# EAGLE schematic pdb (EAGLE 9.1.3)

## Sheet 1 of 6: 5V-Reg
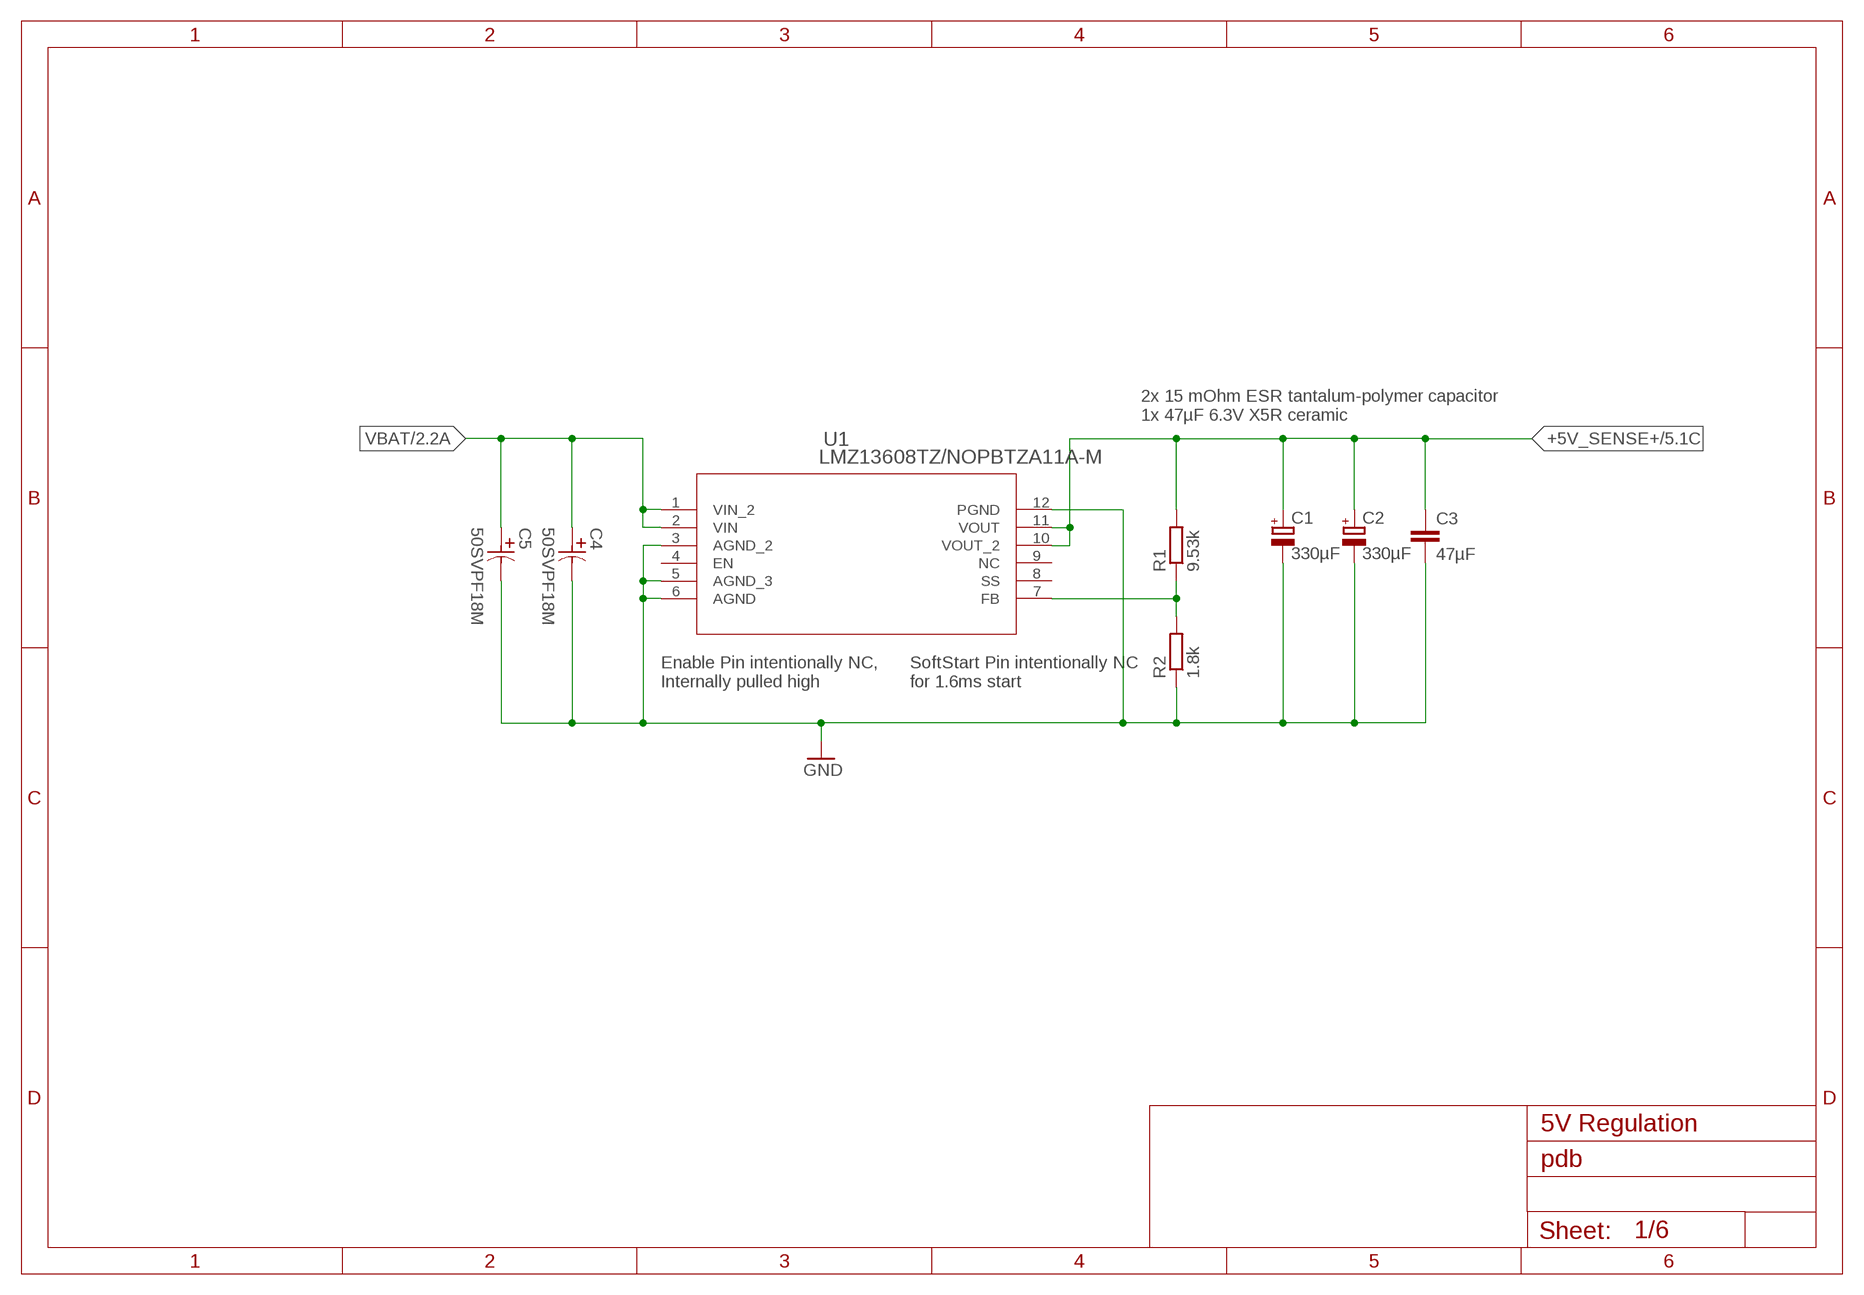
[diagram p0: schematic, sheet 1]

### Parts
C1  330µF  CPOL-EUCT7343  [CT7343]
C2  330µF  CPOL-EUCT7343  [CT7343]
C3  47µF  C-EUC0603  [C0603]
C4  50SVPF18M  [PCAP_SVP_E7]
C5  50SVPF18M  [PCAP_SVP_E7]
R1  9.53k  R-EU_R0603  [R0603]
R2  1.8k  R-EU_R0603  [R0603]
U1  LMZ13608TZ/NOPBTZA11A-M  [TZA11A-M]

### Nets
+5V_SENSE+: C1.+ C2.+ C3.1 R1.2 U1.10(VOUT_2) U1.11(VOUT) ; also sheet 5
GND: C1.- C2.- C3.2 C4.2 C5.2 R2.1 U1.3(AGND_2) U1.5(AGND_3) U1.6(AGND) U1.12(PGND) ; also sheet 2,3,4,5,6
N$1: R1.1 R2.2 U1.7(FB)
VBAT: C4.1 C5.1 U1.1(VIN_2) U1.2(VIN) ; also sheet 2,5,6
Unconnected: U1.4(EN) U1.8(SS) U1.9(NC)

### Notes on the sheet
- 2x 15 mOhm ESR tantalum-polymer capacitor
  1x 47µF 6.3V X5R ceramic
- Enable Pin intentionally NC,
  Internally pulled high
- SoftStart Pin intentionally NC
  for 1.6ms start
- 5V Regulation

## Sheet 2 of 6: 3.3V-Reg
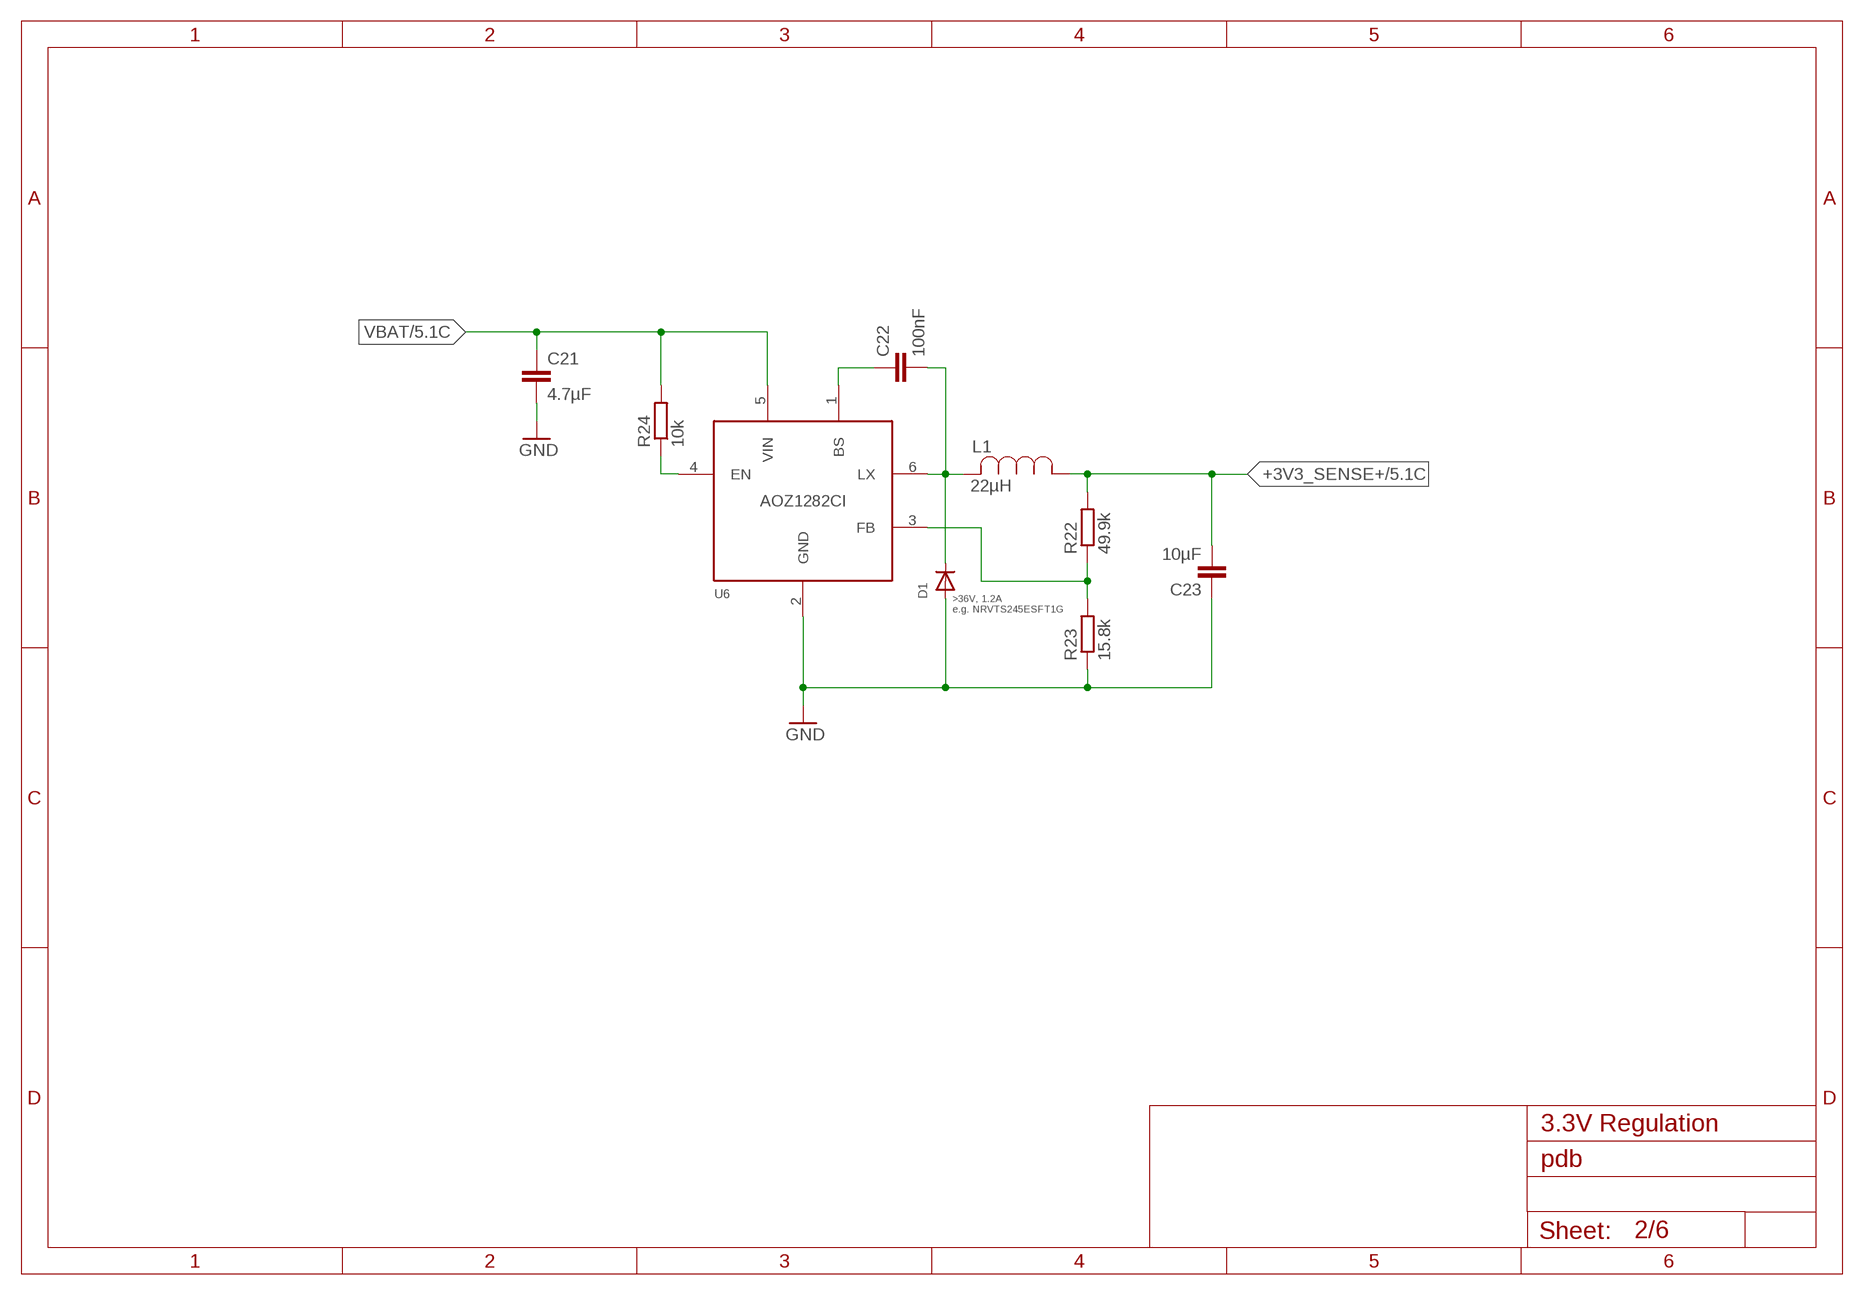
[diagram p1: schematic, sheet 2]

### Parts
C21  4.7µF  C-EUC0603  [C0603]
C22  100nF  C-EUC0603  [C0603]
C23  10µF  C-EUC0603  [C0603]
D1  DIODE_SOD-123FL  [SOD-123FL]
L1  22µH  NRS6045  [IND_TAIYO_NRS6045]
R22  49.9k  R-EU_R0603  [R0603]
R23  15.8k  R-EU_R0603  [R0603]
R24  10k  R-EU_R0603  [R0603]
U6  AOZ1282CI  [SOT95P280X125-6]

### Nets
+3V3_SENSE+: C23.2 L1.1 R22.2 ; also sheet 5
GND: C21.2 C23.1 D1.A R23.1 U6.2(GND) ; also sheet 1,3,4,5,6
N$24: R22.1 R23.2 U6.3(FB)
N$27: C22.2 D1.C L1.2 U6.6(LX)
N$28: C22.1 U6.1(BS)
N$30: R24.1 U6.4(EN)
VBAT: C21.1 R24.2 U6.5(VIN) ; also sheet 1,5,6

### Notes on the sheet
- >36V, 1.2A
  e.g. NRVTS245ESFT1G
- 3.3V Regulation

## Sheet 3 of 6: Microcontroller
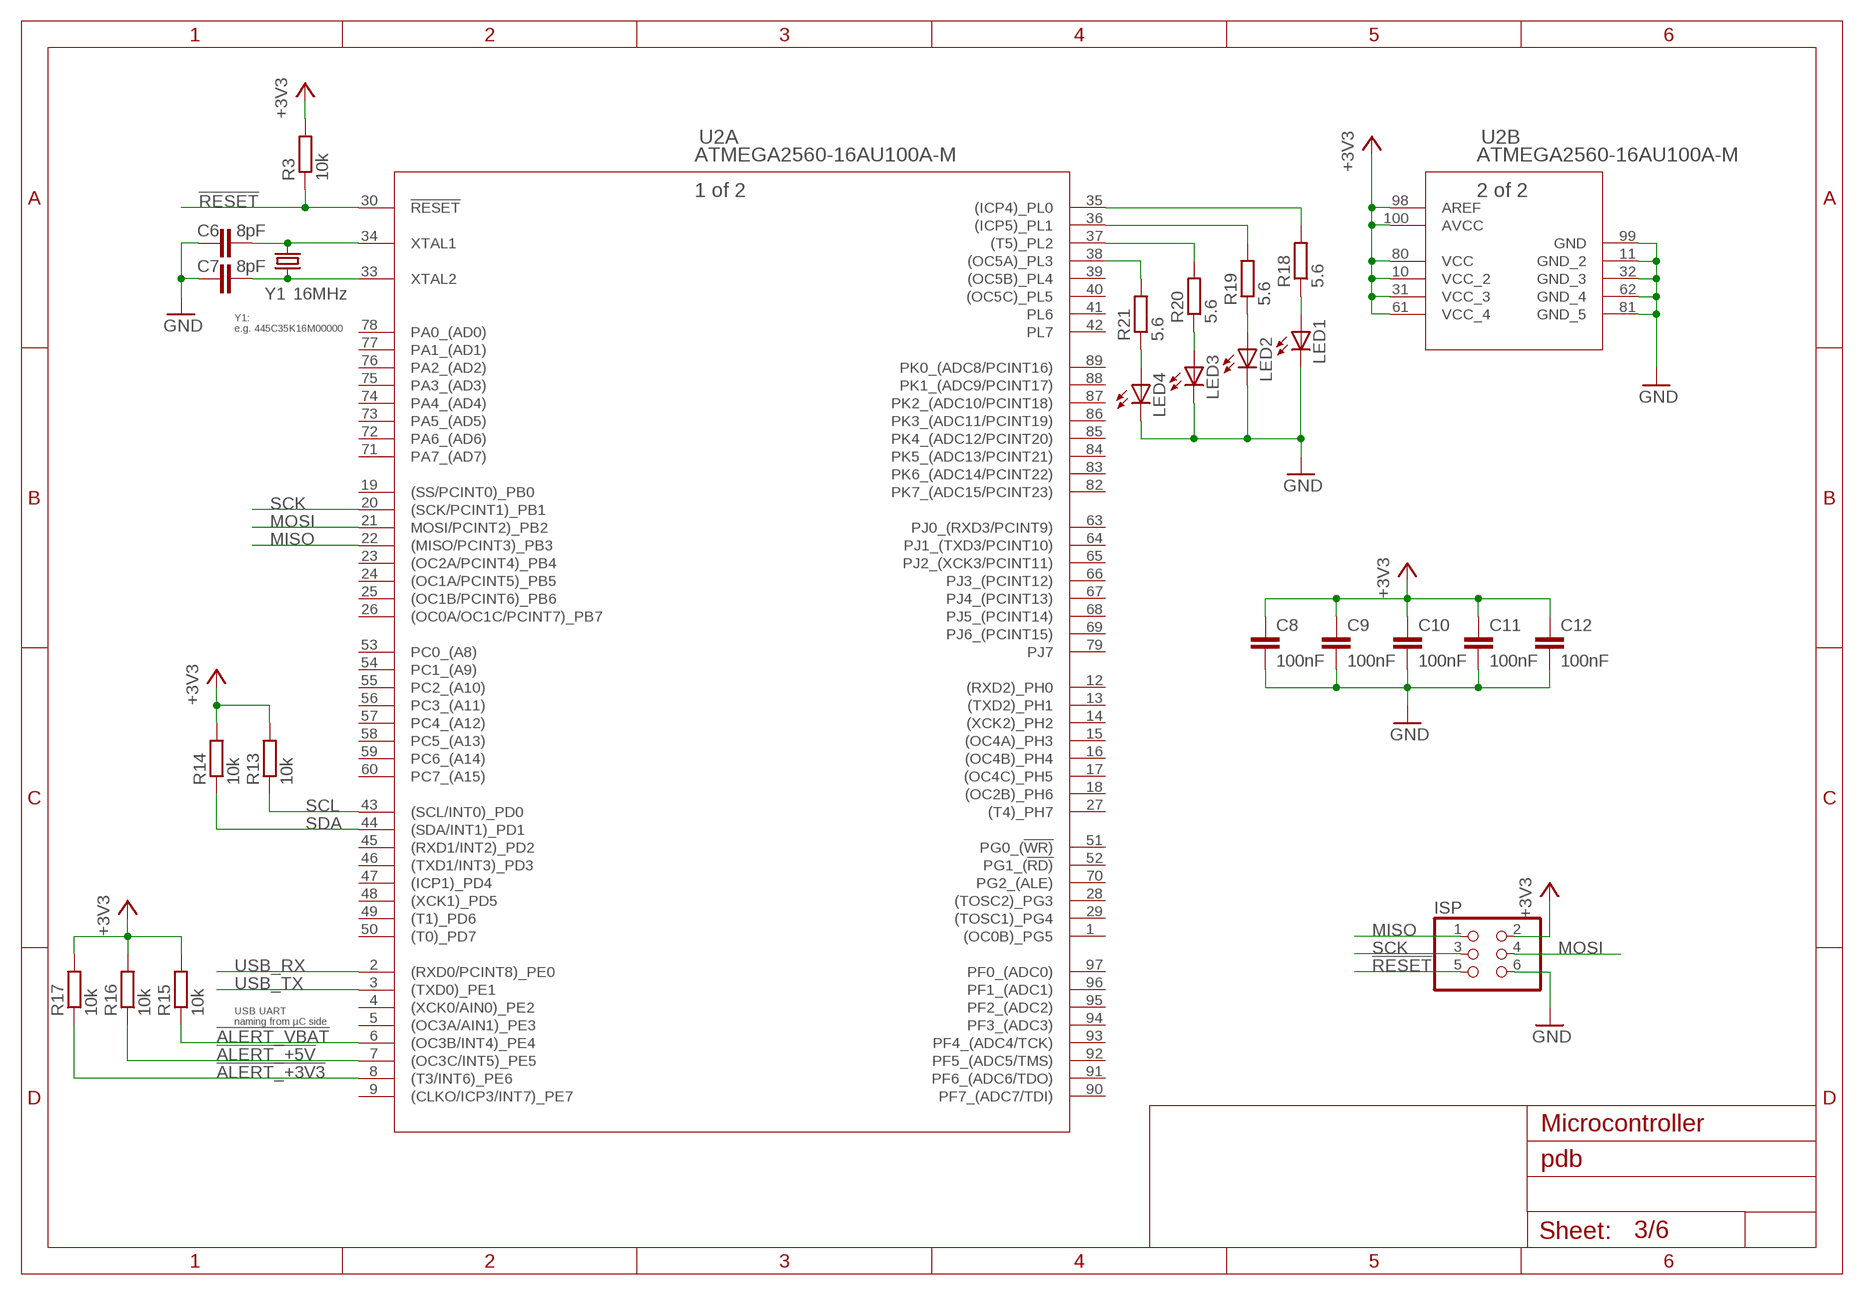
[diagram p2: schematic, sheet 3]

### Parts
C6  8pF  C-EUC0603  [C0603]
C7  8pF  C-EUC0603  [C0603]
C8  100nF  C-EUC0603  [C0603]
C9  100nF  C-EUC0603  [C0603]
C10  100nF  C-EUC0603  [C0603]
C11  100nF  C-EUC0603  [C0603]
C12  100nF  C-EUC0603  [C0603]
ISP  PINHD-2X3  [2X03]
LED1  LEDCHIP-LED0603  [CHIP-LED0603]
LED2  LEDCHIP-LED0603  [CHIP-LED0603]
LED3  LEDCHIP-LED0603  [CHIP-LED0603]
LED4  LEDCHIP-LED0603  [CHIP-LED0603]
R3  10k  R-EU_R0603  [R0603]
R13  10k  R-EU_R0603  [R0603]
R14  10k  R-EU_R0603  [R0603]
R15  10k  R-EU_R0603  [R0603]
R16  10k  R-EU_R0603  [R0603]
R17  10k  R-EU_R0603  [R0603]
R18  5.6  R-EU_R0603  [R0603]
R19  5.6  R-EU_R0603  [R0603]
R20  5.6  R-EU_R0603  [R0603]
R21  5.6  R-EU_R0603  [R0603]
U2  ATMEGA2560-16AU100A-M  [100A-M]
Y1  16MHz  CRYSTALSMD-5X3.2-2PAD  [CRYSTAL-SMD-5X3.2-2PAD]

### Nets
!ALERT_+3V3: R17.1 U2.8(A:(T3/INT6)_PE6) ; also sheet 5
!ALERT_+5V: R16.1 U2.7(A:(OC3C/INT5)_PE5) ; also sheet 5
!ALERT_VBAT: R15.1 U2.6(A:(OC3B/INT4)_PE4) ; also sheet 5
!RESET: ISP.5 R3.1 U2.30(A:!RESET)
+3V3: R13.2 R14.2 R15.2 R16.2 R17.2 ; also sheet 5,6
+5V: C8.1 C9.1 C10.1 C11.1 C12.1 ISP.2 R3.2 U2.10(B:VCC_2) U2.31(B:VCC_3) U2.61(B:VCC_4) U2.80(B:VCC) U2.98(B:AREF) U2.100(B:AVCC) ; supply symbol labelled +3V3 ; also sheet 4,5,6
GND: C6.1 C7.1 C8.2 C9.2 C10.2 C11.2 C12.2 ISP.6 LED1.C LED2.C LED3.C LED4.C U2.11(B:GND_2) U2.32(B:GND_3) U2.62(B:GND_4) U2.81(B:GND_5) U2.99(B:GND) ; also sheet 1,2,4,5,6
MISO: ISP.1 U2.22(A:(MISO/PCINT3)_PB3)
MOSI: ISP.4 U2.21(A:MOSI/PCINT2)_PB2)
N$2: C6.2 U2.34(A:XTAL1) Y1.P$2
N$3: C7.2 U2.33(A:XTAL2) Y1.P$1
N$14: R21.2 U2.38(A:(OC5A)_PL3)
N$17: R20.2 U2.37(A:(T5)_PL2)
N$18: R19.2 U2.36(A:(ICP5)_PL1)
N$19: R18.2 U2.35(A:(ICP4)_PL0)
N$20: LED1.A R18.1
N$21: LED2.A R19.1
N$22: LED3.A R20.1
N$23: LED4.A R21.1
SCK: ISP.3 U2.20(A:(SCK/PCINT1)_PB1)
SCL: R13.1 U2.43(A:(SCL/INT0)_PD0) ; also sheet 5
SDA: R14.1 U2.44(A:(SDA/INT1)_PD1) ; also sheet 5
USB_RX: U2.2(A:(RXD0/PCINT8)_PE0) ; also sheet 4
USB_TX: U2.3(A:(TXD0)_PE1) ; also sheet 4
Unconnected: U2.1(A:(OC0B)_PG5) U2.4(A:(XCK0/AIN0)_PE2) U2.5(A:(OC3A/AIN1)_PE3) U2.9(A:(CLKO/ICP3/INT7)_PE7) U2.12(A:(RXD2)_PH0) U2.13(A:(TXD2)_PH1) U2.14(A:(XCK2)_PH2) U2.15(A:(OC4A)_PH3) U2.16(A:(OC4B)_PH4) U2.17(A:(OC4C)_PH5) U2.18(A:(OC2B)_PH6) U2.19(A:(SS/PCINT0)_PB0) U2.23(A:(OC2A/PCINT4)_PB4) U2.24(A:(OC1A/PCINT5)_PB5) U2.25(A:(OC1B/PCINT6)_PB6) U2.26(A:(OC0A/OC1C/PCINT7)_PB7) U2.27(A:(T4)_PH7) U2.28(A:(TOSC2)_PG3) U2.29(A:(TOSC1)_PG4) U2.39(A:(OC5B)_PL4) U2.40(A:(OC5C)_PL5) U2.41(A:PL6) U2.42(A:PL7) U2.45(A:(RXD1/INT2)_PD2) U2.46(A:(TXD1/INT3)_PD3) U2.47(A:(ICP1)_PD4) U2.48(A:(XCK1)_PD5) U2.49(A:(T1)_PD6) U2.50(A:(T0)_PD7) U2.51(A:PG0_(!WR)) U2.52(A:PG1_(!RD)) U2.53(A:PC0_(A8)) U2.54(A:PC1_(A9)) U2.55(A:PC2_(A10)) U2.56(A:PC3_(A11)) U2.57(A:PC4_(A12)) U2.58(A:PC5_(A13)) U2.59(A:PC6_(A14)) U2.60(A:PC7_(A15)) U2.63(A:PJ0_(RXD3/PCINT9)) U2.64(A:PJ1_(TXD3/PCINT10)) U2.65(A:PJ2_(XCK3/PCINT11)) U2.66(A:PJ3_(PCINT12)) U2.67(A:PJ4_(PCINT13)) U2.68(A:PJ5_(PCINT14)) U2.69(A:PJ6_(PCINT15)) U2.70(A:PG2_(ALE)) U2.71(A:PA7_(AD7)) U2.72(A:PA6_(AD6)) U2.73(A:PA5_(AD5)) U2.74(A:PA4_(AD4)) U2.75(A:PA3_(AD3)) U2.76(A:PA2_(AD2)) U2.77(A:PA1_(AD1)) U2.78(A:PA0_(AD0)) U2.79(A:PJ7) U2.82(A:PK7_(ADC15/PCINT23)) U2.83(A:PK6_(ADC14/PCINT22)) U2.84(A:PK5_(ADC13/PCINT21)) U2.85(A:PK4_(ADC12/PCINT20)) U2.86(A:PK3_(ADC11/PCINT19)) U2.87(A:PK2_(ADC10/PCINT18)) U2.88(A:PK1_(ADC9/PCINT17)) U2.89(A:PK0_(ADC8/PCINT16)) U2.90(A:PF7_(ADC7/TDI)) U2.91(A:PF6_(ADC6/TDO)) U2.92(A:PF5_(ADC5/TMS)) U2.93(A:PF4_(ADC4/TCK)) U2.94(A:PF3_(ADC3)) U2.95(A:PF2_(ADC2)) U2.96(A:PF1_(ADC1)) U2.97(A:PF0_(ADC0))

### Notes on the sheet
- Y1:
  e.g. 445C35K16M00000
- USB UART
  naming from µC side
- Microcontroller

## Sheet 4 of 6: USB-UART
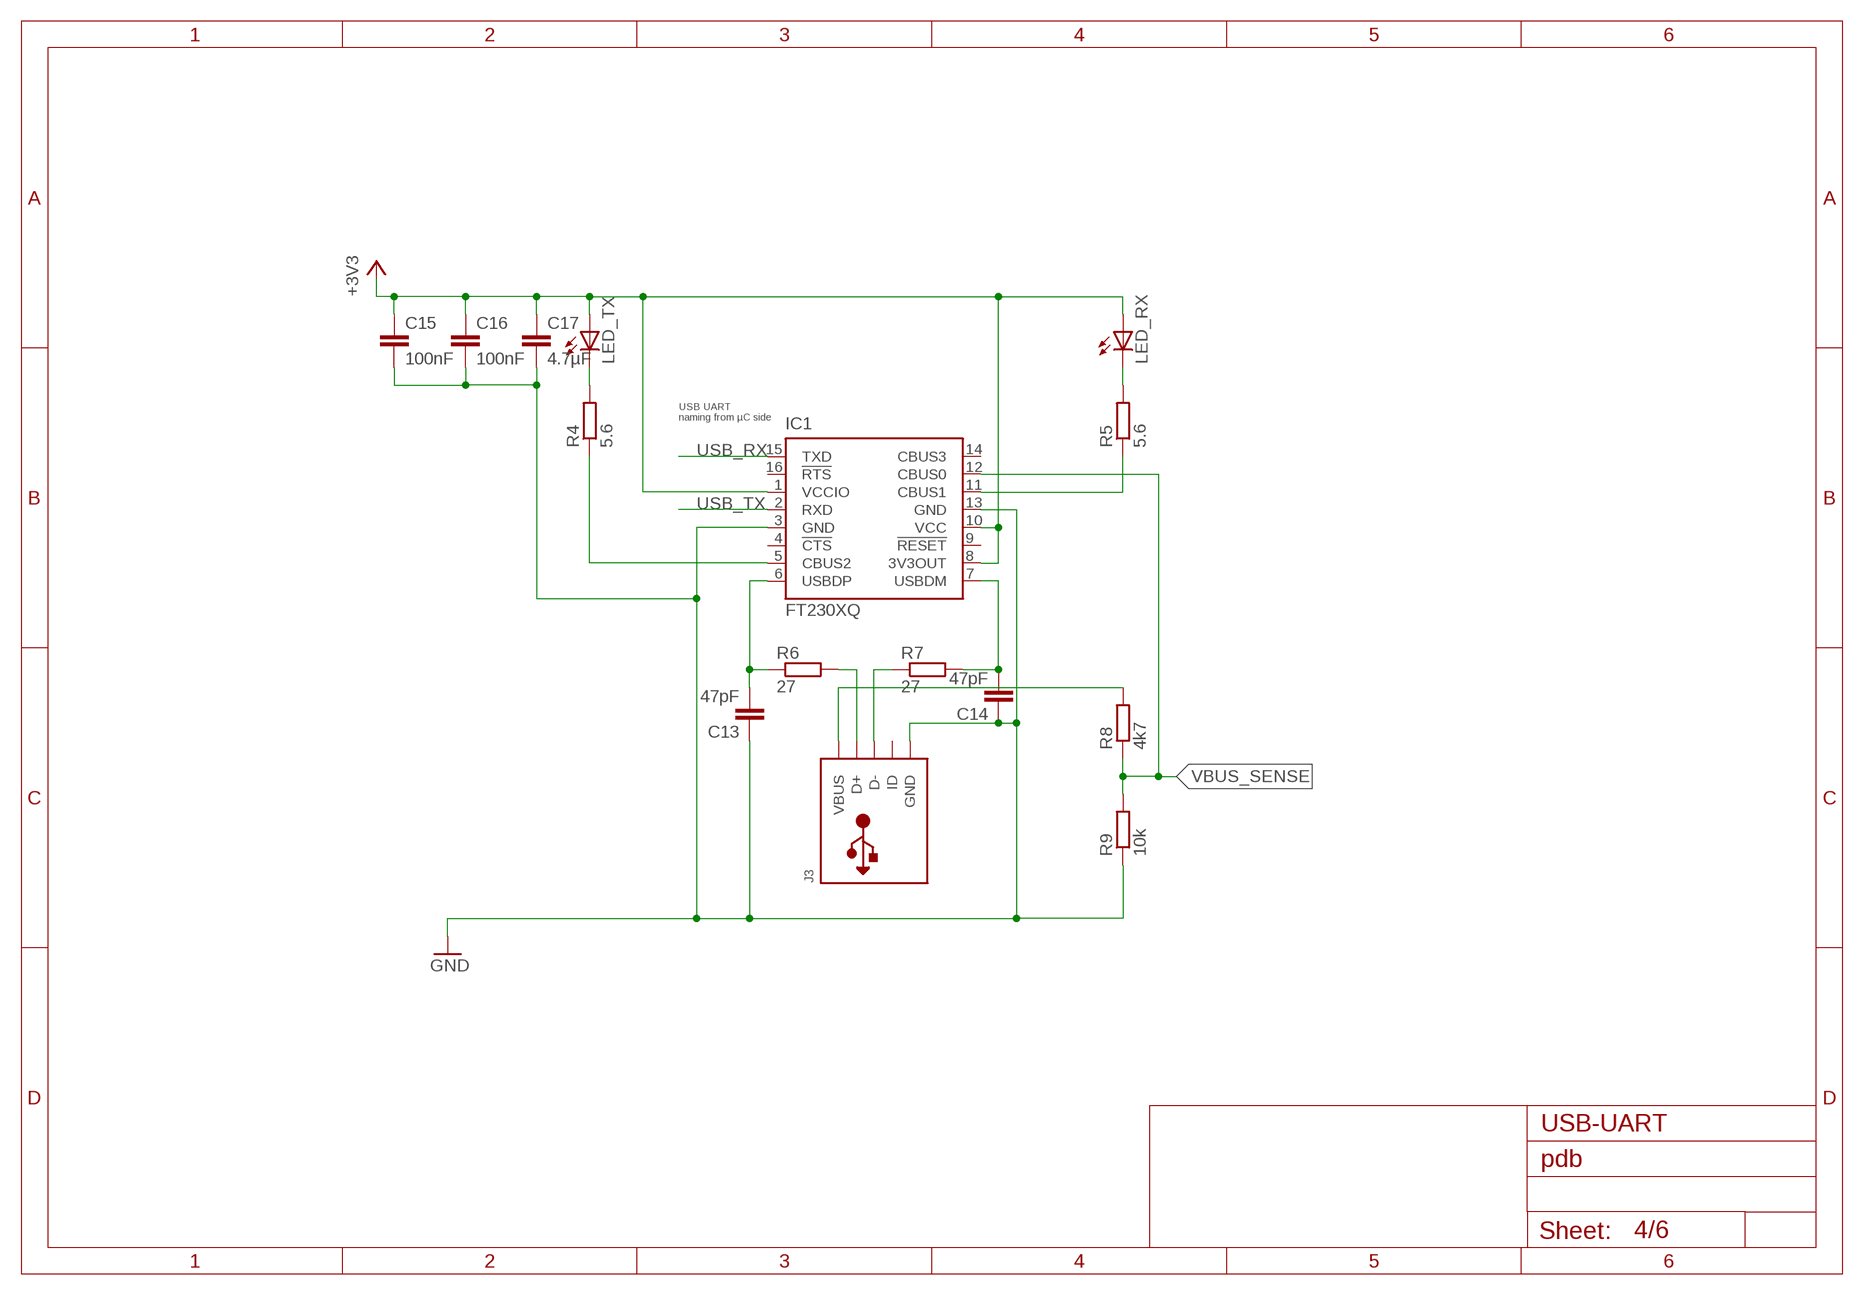
[diagram p3: schematic, sheet 4]

### Parts
C13  47pF  C-EUC0603  [C0603]
C14  47pF  C-EUC0603  [C0603]
C15  100nF  C-EUC0603  [C0603]
C16  100nF  C-EUC0603  [C0603]
C17  4.7µF  C-EUC0603  [C0603]
IC1  FT230XQ  [QFN16]
J3  USBMINIB  [USB-MINIB]
LED_RX  LEDCHIP-LED0603  [CHIP-LED0603]
LED_TX  LEDCHIP-LED0603  [CHIP-LED0603]
R4  5.6  R-EU_R0603  [R0603]
R5  5.6  R-EU_R0603  [R0603]
R6  27  R-EU_R0603  [R0603]
R7  27  R-EU_R0603  [R0603]
R8  4k7  R-EU_R0603  [R0603]
R9  10k  R-EU_R0603  [R0603]

### Nets
+5V: C15.1 C16.1 C17.1 IC1.1(VCCIO) IC1.8(3V3OUT) IC1.10(VCC) LED_RX.A LED_TX.A ; supply symbol labelled +3V3 ; also sheet 3,5,6
GND: C13.1 C14.1 C15.2 C16.2 C17.2 IC1.3(GND) IC1.13(GND) J3.GND R9.1 ; also sheet 1,2,3,5,6
N$4: C13.2 IC1.6(USBDP) R6.1
N$5: C14.2 IC1.7(USBDM) R7.2
N$6: IC1.5(CBUS2) R4.1
N$7: IC1.11(CBUS1) R5.1
N$8: LED_TX.C R4.2
N$9: LED_RX.C R5.2
N$10: J3.D+ R6.2
N$11: J3.D- R7.1
N$16: J3.VBUS R8.2
USB_RX: IC1.15(TXD) ; also sheet 3
USB_TX: IC1.2(RXD) ; also sheet 3
VBUS_SENSE: IC1.12(CBUS0) R8.1 R9.2
Unconnected: IC1.4(!CTS) IC1.9(!RESET) IC1.14(CBUS3) IC1.16(!RTS) J3.ID

### Notes on the sheet
- USB UART
  naming from µC side
- USB-UART

## Sheet 5 of 6: Supply Monitoring
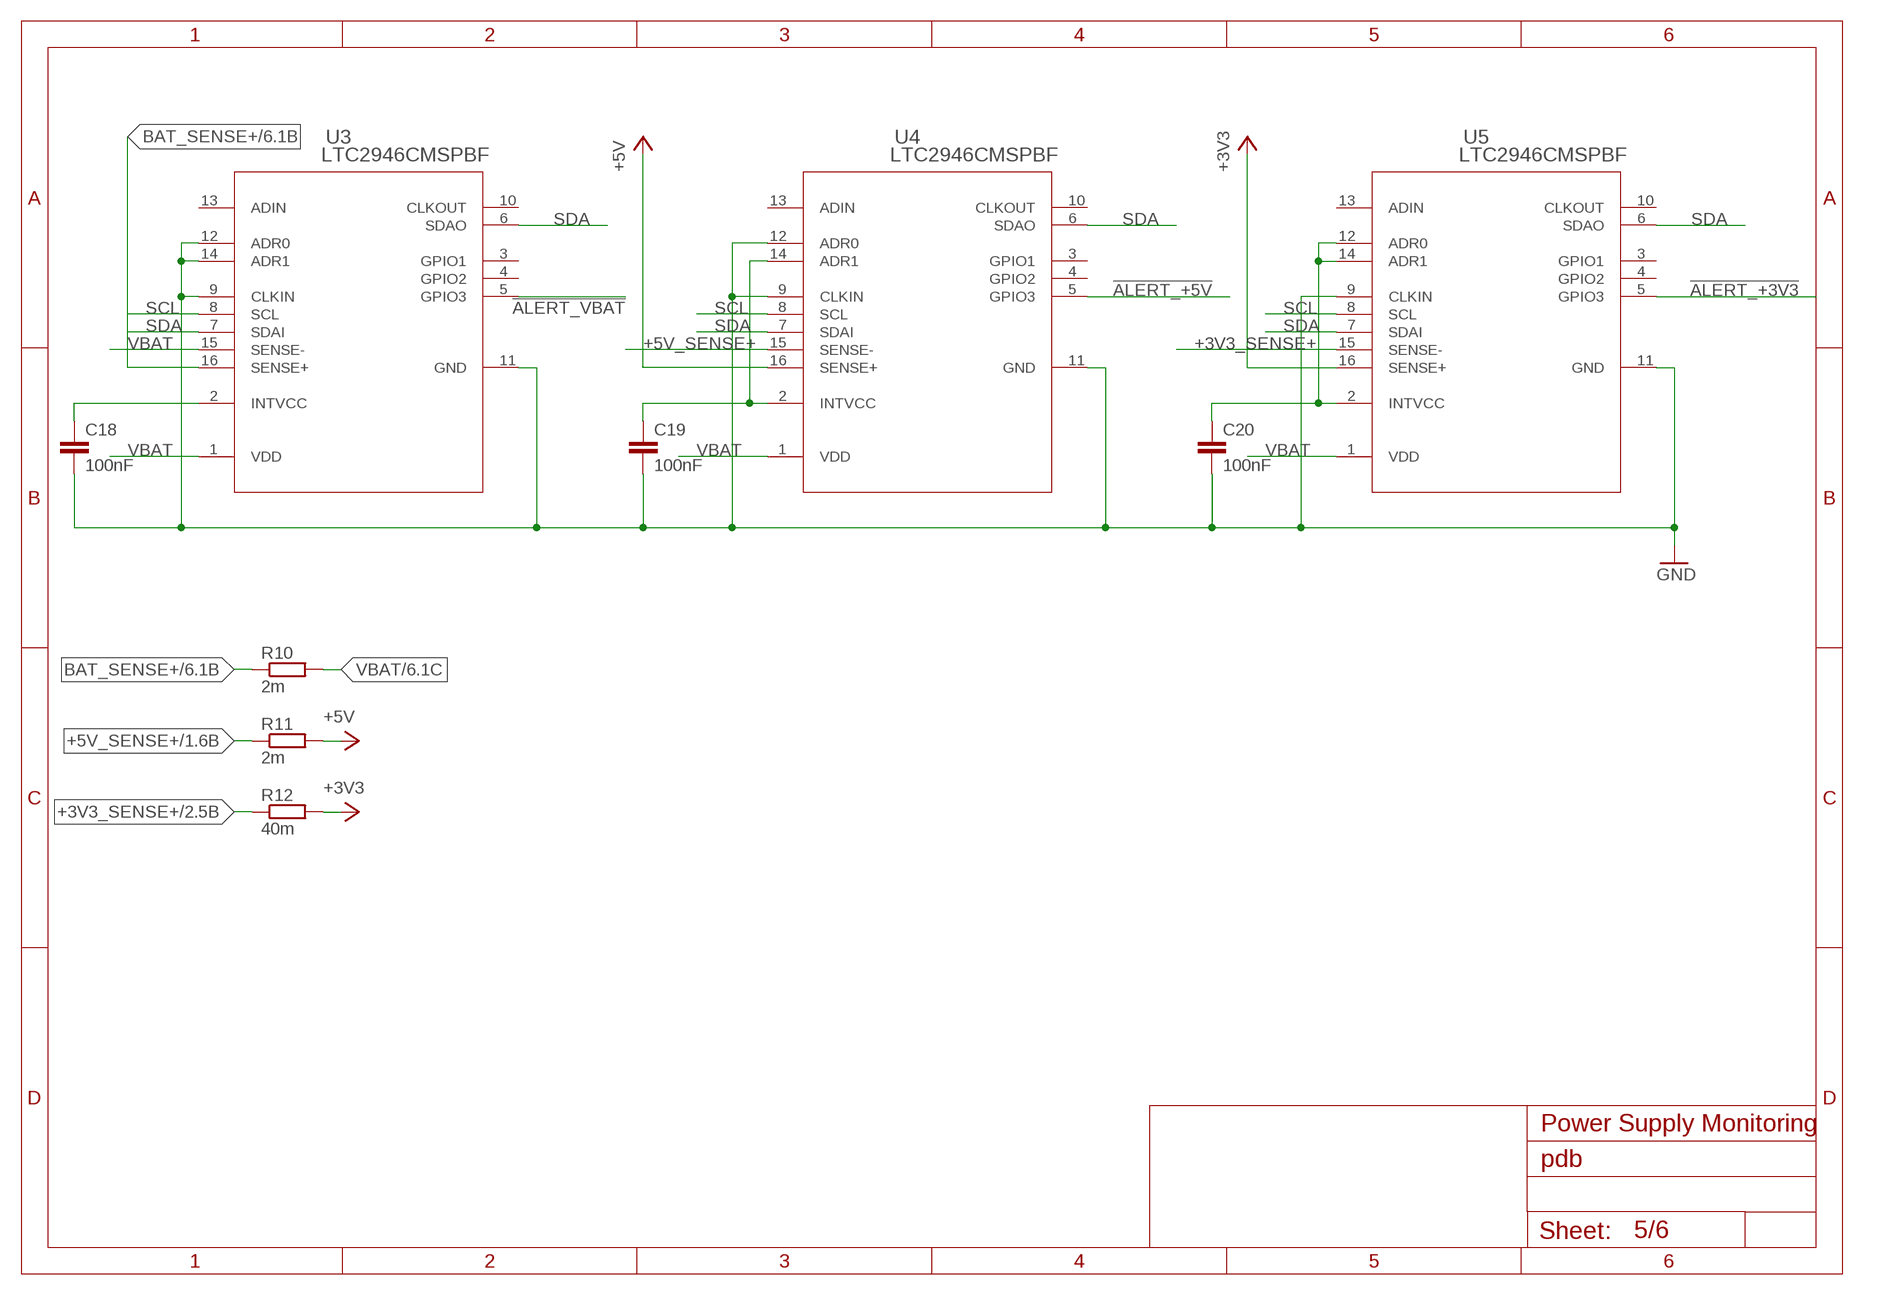
[diagram p4: schematic, sheet 5]

### Parts
C18  100nF  C-EUC0603  [C0603]
C19  100nF  C-EUC0603  [C0603]
C20  100nF  C-EUC0603  [C0603]
R10  2m  CSS2H-3920  [3920]
R11  2m  CSS2H-3920  [3920]
R12  40m  CRA2512-FZ-R040ELF  [BO_CRA2512]
U3  LTC2946CMSPBF  [SOP50P489X110-16]
U4  LTC2946CMSPBF  [SOP50P489X110-16]
U5  LTC2946CMSPBF  [SOP50P489X110-16]

### Nets
!ALERT_+3V3: U5.5(GPIO3) ; also sheet 3
!ALERT_+5V: U4.5(GPIO3) ; also sheet 3
!ALERT_VBAT: U3.5(GPIO3) ; also sheet 3
+3V3: R12.2 U5.16(SENSE+) ; also sheet 3,6
+3V3_SENSE+: R12.1 U5.15(SENSE-) ; also sheet 2
+5V: R11.P$2 U4.16(SENSE+) ; also sheet 3,4,6
+5V_SENSE+: R11.P$1 U4.15(SENSE-) ; also sheet 1
BAT_SENSE+: R10.P$1 U3.16(SENSE+) ; also sheet 6
GND: C18.2 C19.2 C20.2 U3.9(CLKIN) U3.11(GND) U3.12(ADR0) U3.14(ADR1) U4.9(CLKIN) U4.11(GND) U4.12(ADR0) U5.9(CLKIN) U5.11(GND) ; also sheet 1,2,3,4,6
N$12: C18.1 U3.2(INTVCC)
N$13: C19.1 U4.2(INTVCC) U4.14(ADR1)
N$15: C20.1 U5.2(INTVCC) U5.12(ADR0) U5.14(ADR1)
SCL: U3.8(SCL) U4.8(SCL) U5.8(SCL) ; also sheet 3
SDA: U3.6(SDAO) U3.7(SDAI) U4.6(SDAO) U4.7(SDAI) U5.6(SDAO) U5.7(SDAI) ; also sheet 3
VBAT: R10.P$2 U3.1(VDD) U3.15(SENSE-) U4.1(VDD) U5.1(VDD) ; also sheet 1,2,6
Unconnected: U3.3(GPIO1) U3.4(GPIO2) U3.10(CLKOUT) U3.13(ADIN) U4.3(GPIO1) U4.4(GPIO2) U4.10(CLKOUT) U4.13(ADIN) U5.3(GPIO1) U5.4(GPIO2) U5.10(CLKOUT) U5.13(ADIN)

### Notes on the sheet
- Power Supply Monitoring

## Sheet 6 of 6: Connector
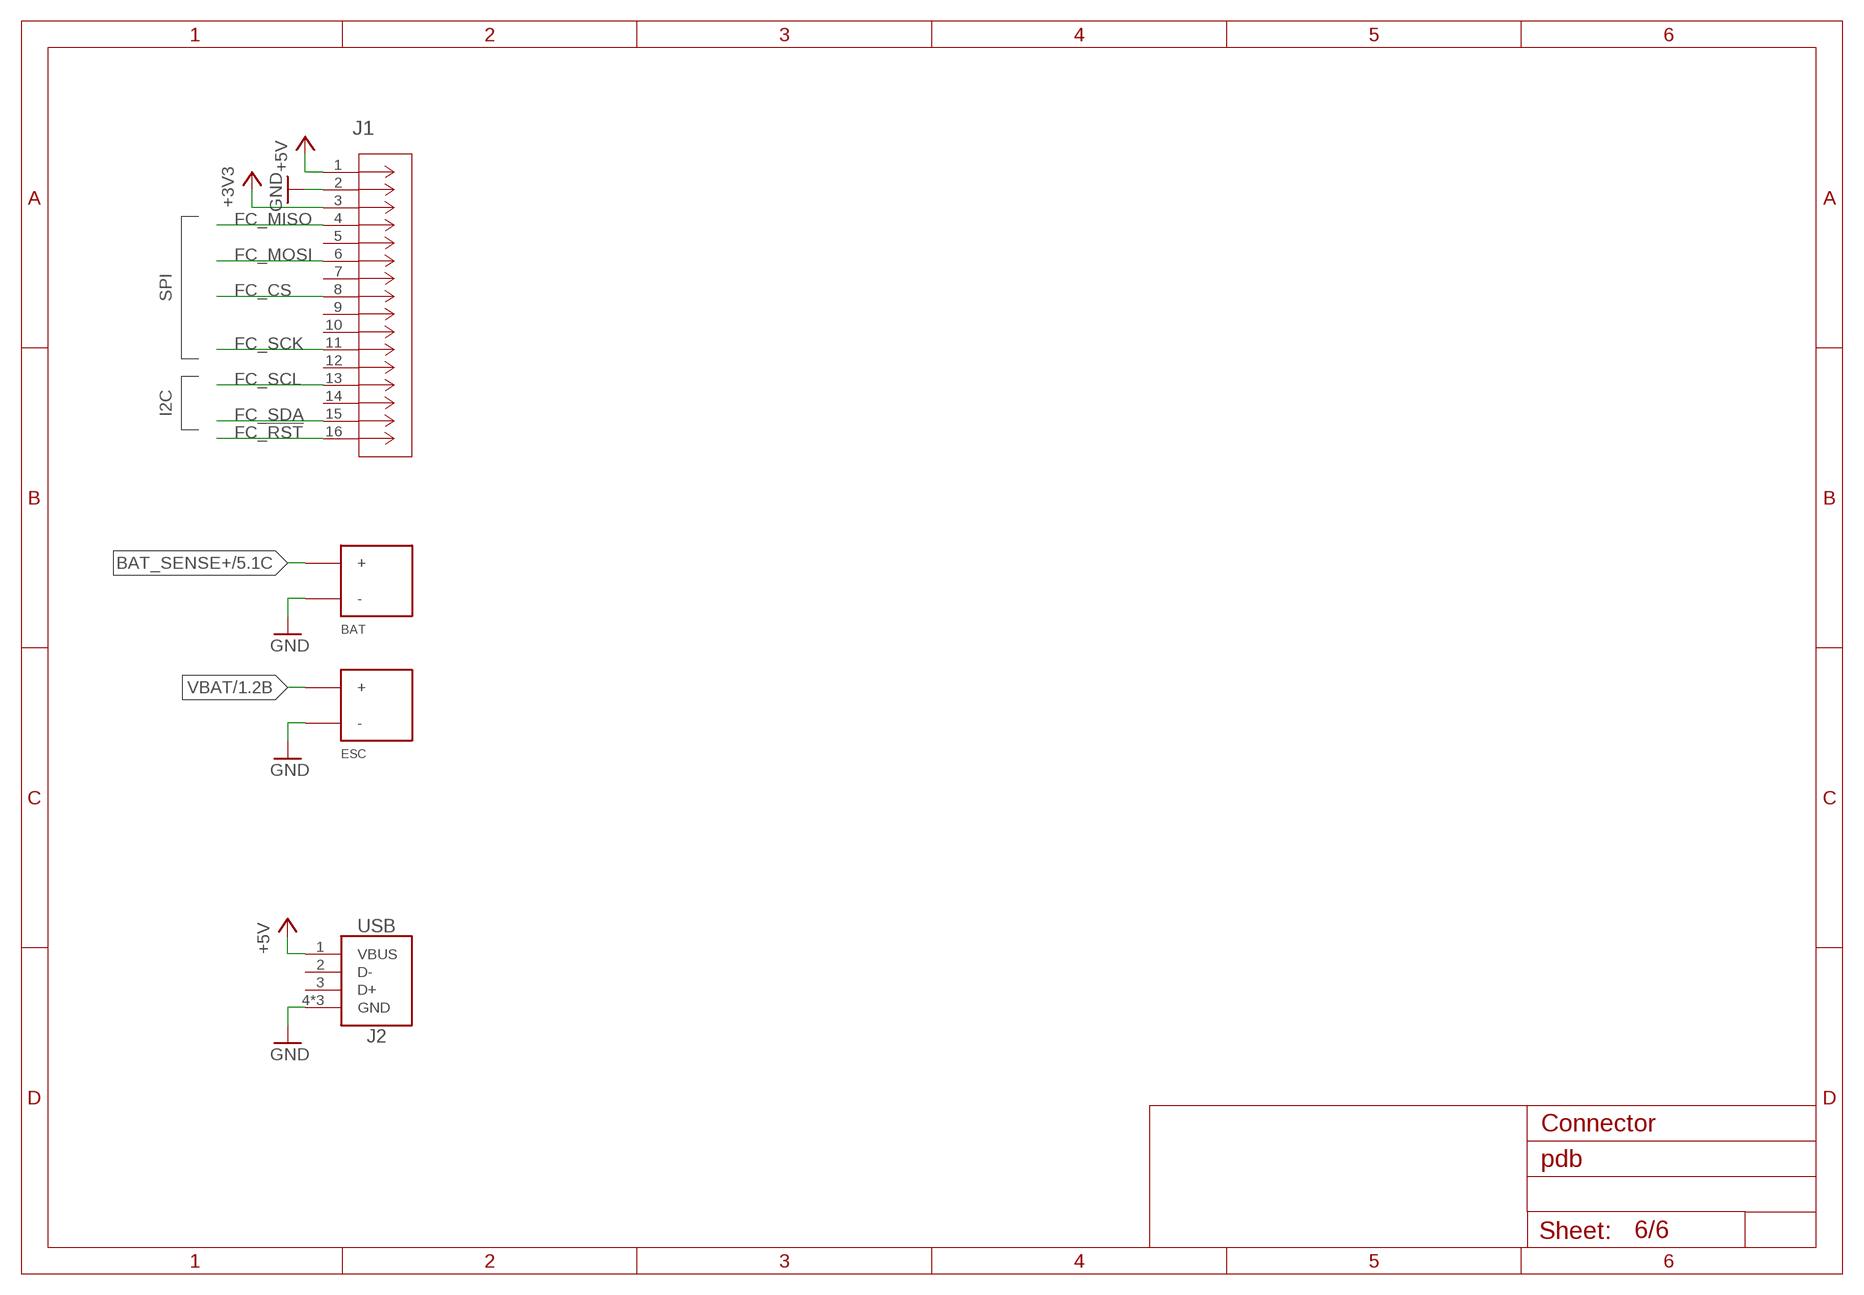
[diagram p5: schematic, sheet 6]

### Parts
BAT  XT60PWMALE  [XT60PWMALE]
ESC  XT60PWFEMALE  [XT60PWFEMALE]
J1  1-338068-6  [CONN_1-338068-6]
J2  USB-A  [USB-A]

### Nets
+3V3: J1.3 ; also sheet 3,5
+5V: J1.1 J2.1(VBUS) ; also sheet 3,4,5
BAT_SENSE+: BAT.POS(+) ; also sheet 5
FC_!RST: J1.16
FC_CS: J1.8
FC_MISO: J1.4
FC_MOSI: J1.6
FC_SCK: J1.11
FC_SCL: J1.13
FC_SDA: J1.15
GND: BAT.NEG(-) ESC.NEG(-) J1.2 J2.4(GND) J2.5(GND) J2.6(GND) ; also sheet 1,2,3,4,5
VBAT: ESC.POS(+) ; also sheet 1,2,5
Unconnected: J1.5 J1.7 J1.9 J1.10 J1.12 J1.14 J2.2(D-) J2.3(D+)

### Notes on the sheet
- SPI
- I2C
- Connector

## Library data of the parts
BAT ESC = amass:XT60PW
C1 C2 = rcl:CPOL-EU: POLARIZED CAPACITOR, European symbol; SPICEPREFIX: C
C3 C6-C23 = rcl:C-EU: CAPACITOR, European symbol; SPICEPREFIX: C
C4 C5 = 50SVPF18M:50SVPF18M; MANUFACTURER_PART_NUMBER: 50SVPF18M; VENDOR: Panasonic
D1 = adafruit:DIODE: Diode SMADIODE - SMA Surface Mount Package 20V 1A Schottky Diode Digikey: 641-1014-6-ND DO-1N4148 - Through Hole Small Current Diode SOD-123 20V 1 A (.5mV Vf) Schottky Diode - Digikey: MBRX120TPMSCT-ND SOD-323 10V 570mA (.38mV Vf, 3ns) Schottky Diode - Digikey: ZLLS410CT-ND SOD-523 30V 30mA Schottky Diode (RB751S-40TE61) - Digikey: RB751S-40TE61CT-ND SOT23-R/W - SOT23 Package (R = Solder Paste/Reflow Ovens, W = Hand-Soldering) BAT54Film 40V 300mA - Digikey: 497-7162-1-ND; DIGIKEYNR: NRVTS245ESFT1G
IC1 = ftdichip:FT230X: USB to BASIC UART IC Auto generated by make-symbol-device-package-bsdl.ulp Rev. 43 Source: Data sheet <http://www.ftdichip.com/Support/Documents/DataSheets/ICs/DS_FT230X.pdf>
ISP = pinhead:PINHD-2X3: PIN HEADER
J1 = TE-MicroMatch:1-338068-6; MANUFACTURER_PART_NUMBER: 13380686; VENDOR: TE Connectivity
J2 = USB:USB-A; DIGI-KEY-PN: 380-1412-ND; MPN: SS-52100-001
J3 = adafruit:USB: USB Connectors USBMINIB - Surface Mount Female Mini-B USB Connector 4UConnector: 06564 By microbuilder.eu Thru-hole RA Female Mini-B USB Connector 4UConnector: 18732 By ladyada.net
L1 = inductor:NRS6045; MANUFACTURER_PART_NUMBER: NRS6045T220MMGK; VENDOR: TAIYO YUDEN
LED1-LED4 LED_RX LED_TX = led:LED: LED OSRAM: - CHIPLED LG R971, LG N971, LY N971, LG Q971, LY Q971, LO R971, LY R971 LH N974, LH R974 LS Q976, LO Q976, LY Q976 LO Q996 - Hyper CHIPLED LW Q18S LB Q993, LB Q99A, LB R99A - SideLED LS A670, LO A670, LY A670, LG A670, LP A670 LB A673, LV A673, LT A673, LW A673 LH A674 LY A675 LS A676, LA A676, LO A676, LY A676, LW A676 LS A679, LY A679, LG A679 - Hyper Micro SIDELED® LS Y876, LA Y876, LO Y876, LY Y876 LT Y87S - SmartLED LW L88C, LW L88S LB L89C, LB L89S, LG L890 LS L89K, LO L89K, LY L89K LS L896, LA L896, LO L896, LY L896 - TOPLED LS T670, LO T670, LY T670, LG T670, LP T670 LSG T670, LSP T670, LSY T670, LOP T670, LYG T670 LG T671, LOG T671, LSG T671 LB T673, LV T673, LT T673, LW T673 LH T674 LS T676, LA T676, LO T676, LY T676, LB T676, LH T676, LSB T676, LW T676 LB T67C, LV T67C, LT T67C, LS T67K, LO T67K, LY T67K, LW E67C LS E67B, LA E67B, LO E67B, LY E67B, LB E67C, LV E67C, LT E67C LW T67C LS T679, LY T679, LG T679 LS T770, LO T770, LY T770, LG T770, LP T770 LB T773, LV T773, LT T773, LW T773 LH T774 LS E675, LA E675, LY E675, LS T675 LS T776, LA T776, LO T776, LY T776, LB T776 LHGB T686 LT T68C, LB T68C - Hyper Mini TOPLED® LB M676 - Mini TOPLED Santana® LG M470 LS M47K, LO M47K, LY M47K Source: http://www.osram.convergy.de LUXEON: - LUMILED® LXK2-PW12-R00, LXK2-PW12-S00, LXK2-PW14-U00, LXK2-PW14-V00 LXK2-PM12-R00, LXK2-PM12-S00, LXK2-PM14-U00 LXK2-PE12-Q00, LXK2-PE12-R00, LXK2-PE12-S00, LXK2-PE14-T00, LXK2-PE14-U00 LXK2-PB12-K00, LXK2-PB12-L00, LXK2-PB12-M00, LXK2-PB14-N00, LXK2-PB14-P00, LXK2-PB14-Q00 LXK2-PR12-L00, LXK2-PR12-M00, LXK2-PR14-Q00, LXK2-PR14-R00 LXK2-PD12-Q00, LXK2-PD12-R00, LXK2-PD12-S00 LXK2-PH12-R00, LXK2-PH12-S00 LXK2-PL12-P00, LXK2-PL12-Q00, LXK2-PL12-R00 Source: www.luxeon.com KINGBRIGHT: KA-3528ASYC Source: www.kingbright.com
R1-R9 R13-R24 = rcl:R-EU_: RESISTOR, European symbol; SPICEPREFIX: R
R10 = shunt_resistor:CSS2H-3920; SPICEPREFIX: R
R11 = shunt_resistor:CSS2H-3920
R12 = shunt_resistor:CRA2512-FZ-R040ELF; MANUFACTURER_PART_NUMBER: CRA2512FZR040ELF; VENDOR: Bourns Electronics
U1 = LMZ13608TZ:LMZ13608TZ/NOPB; MANUFACTURER_PART_NUMBER: LMZ13608TZNOPB; VENDOR: Texas Instruments
U2 = ATMEGA2560:ATMEGA2560-16AU; MANUFACTURER_PART_NUMBER: ATMEGA256016AU; VENDOR: Atmel
U3-U5 = LTC2946:LTC2946CMSPBF
U6 = AOZ1282CI:AOZ1282CI
Y1 = SparkFun-Clocks:CRYSTAL: Crystals (Generic) These are passive quartz crystals, which can be used as a clock source for a microcontroller. Crystal's are two-terminal devices. They require external "load" capacitors to generate an oscillating signal.